# Altium schematic sheet KeyInput_MG.SchDoc
size A4
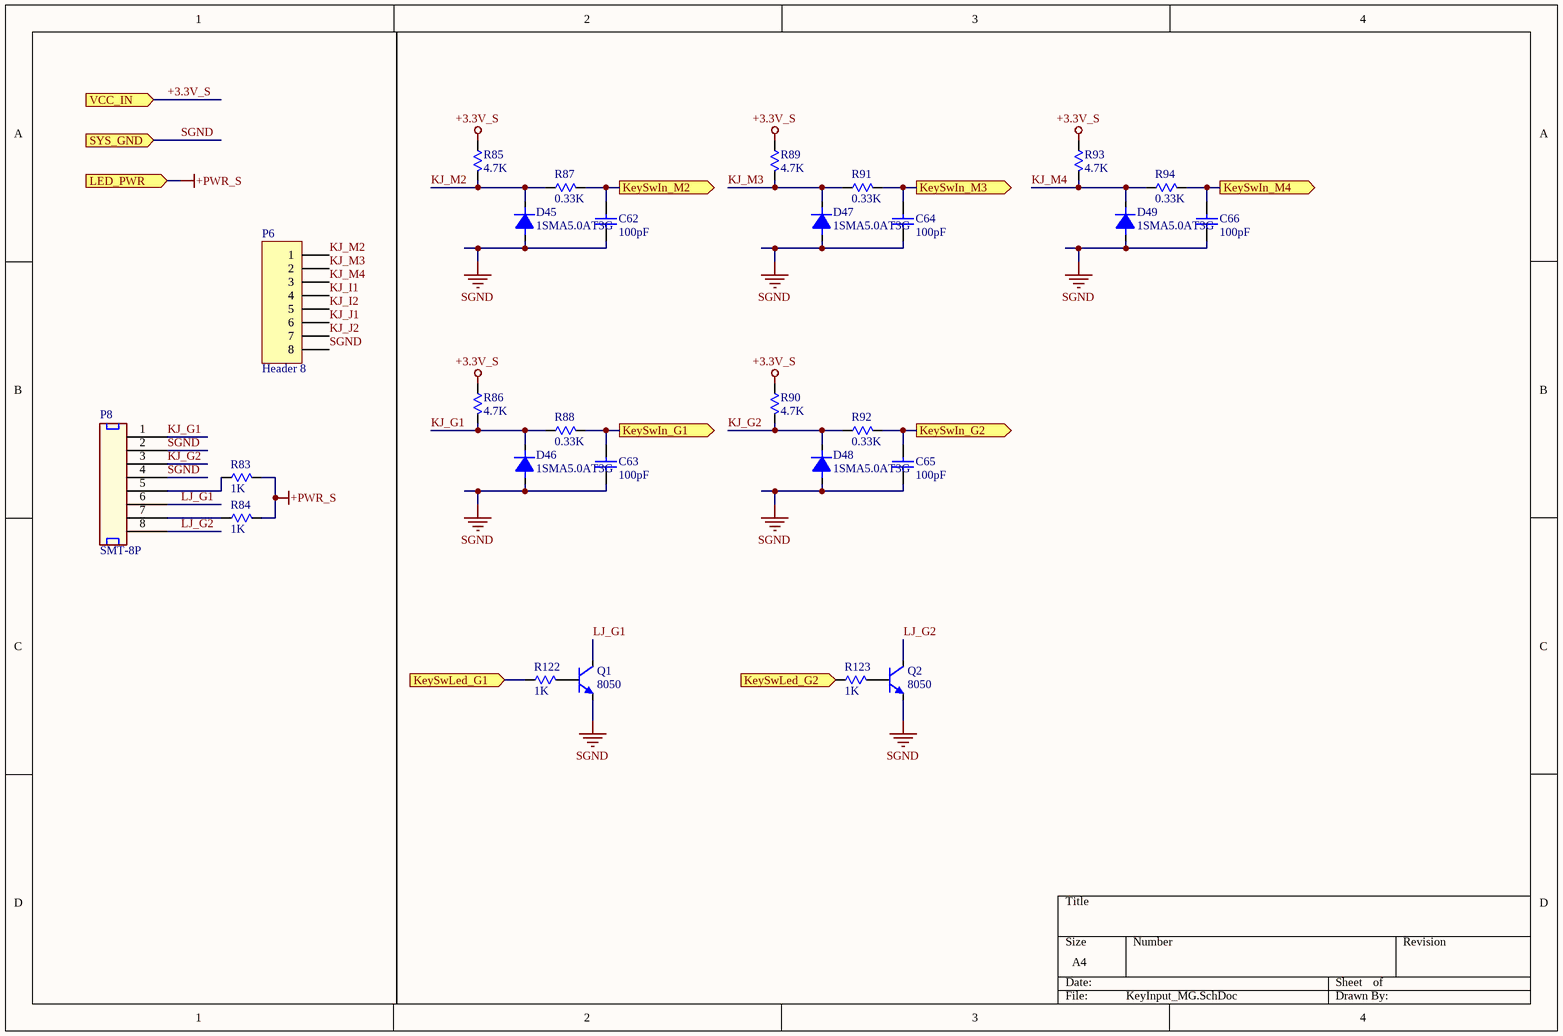
[diagram p0: KeyInput_MG.SchDoc]

## Parts
C62  100pF  [C0805]
C63  100pF  [C0805]
C64  100pF  [C0805]
C65  100pF  [C0805]
C66  100pF  [C0805]
D45  1SMA5.0AT3G  [SMA]
D46  1SMA5.0AT3G  [SMA]
D47  1SMA5.0AT3G  [SMA]
D48  1SMA5.0AT3G  [SMA]
D49  1SMA5.0AT3G  [SMA]
P6  Header 8  [FFC/SM1.0-8]
P8  SMT-8P  [1MM25_8PIN_SMT_R90]
Q1  8050  [SOT-23]
Q2  8050  [SOT-23]
R83  1K  [R0805]
R84  1K  [R0805]
R85  4.7K  [R0805]
R86  4.7K  [R0805]
R87  0.33K  [R0805]
R88  0.33K  [R0805]
R89  4.7K  [R0805]
R90  4.7K  [R0805]
R91  0.33K  [R0805]
R92  0.33K  [R0805]
R93  4.7K  [R0805]
R94  0.33K  [R0805]
R122  1K  [R0805]
R123  1K  [R0805]

## Ports
KeySwIn_G1 (out), KeySwIn_G2 (out), KeySwIn_M2 (out), KeySwIn_M3 (out), KeySwIn_M4 (out), KeySwLed_G1 (in), KeySwLed_G2 (in), LED_PWR (in), SYS_GND (in), VCC_IN (in)

## Nets
+3.3V_S: R85.2 R86.2 R89.2 R90.2 R93.2 ; port VCC_IN
+PWR_S: R83.1 R84.1 ; port LED_PWR
SGND: C62.2 C63.2 C64.2 C65.2 C66.2 D45.1(A) D46.1(A) D47.1(A) D48.1(A) D49.1(A) P6.8 P8.2 P8.4 Q1.2(E) Q2.2(E) ; port SYS_GND
KeySwIn_G1: C63.1 R88.1 ; port KeySwIn_G1
KeySwIn_G2: C65.1 R92.1 ; port KeySwIn_G2
KeySwIn_M2: C62.1 R87.1 ; port KeySwIn_M2
KeySwIn_M3: C64.1 R91.1 ; port KeySwIn_M3
KeySwIn_M4: C66.1 R94.1 ; port KeySwIn_M4
KeySwLed_G1: R122.2 ; port KeySwLed_G1
KeySwLed_G2: R123.2 ; port KeySwLed_G2
KJ_G1: D46.2(K) P8.1 R86.1 R88.2
KJ_G2: D48.2(K) P8.3 R90.1 R92.2
KJ_I1: P6.4
KJ_I2: P6.5
KJ_J1: P6.6
KJ_J2: P6.7
KJ_M2: D45.2(K) P6.1 R85.1 R87.2
KJ_M3: D47.2(K) P6.2 R89.1 R91.2
KJ_M4: D49.2(K) P6.3 R93.1 R94.2
LJ_G1: P8.6 Q1.3(C)
LJ_G2: P8.8 Q2.3(C)
NetP8_5: P8.5 R83.2
NetP8_7: P8.7 R84.2
NetQ1_1: Q1.1(B) R122.1
NetQ2_1: Q2.1(B) R123.1

## Library data of the parts
C62-C66 = Cap: Capacitor; Value: 22pF; Published: 8-Jun-2000; Revision: July-2002: Re-released for DXP Platform.; Publisher: Altium Limited
D45-D49 = DIODE1: Diode
P6 = Header 8: Header, 8-Pin; LatestRevisionDate: 17-Jul-2002; LatestRevisionNote: Re-released for DXP Platform.; Publisher: Altium Limited
Q1 Q2 = NPN: NPN General Purpose Amplifier; Published: 8-Jun-2000; LatestRevisionDate: 15-Jan-2003; LatestRevisionNote: PCB Footprint 'BCY-W3/D4.7' replaced; DatasheetDocument: 1997; PackageDocument: Sep-1998; PackageReference: TO-92A; Publisher: Altium Limited; Code_JEDEC: TO-92A; ComponentLink1Description: Manufacturer Link; ComponentLink1URL: http://www.fairchildsemi.com/; ComponentLink2Description: Datasheet; ComponentLink2URL: http://www.fairchildsemi.com/ds/2N%2F2N3904.pdf
R83-R94 R122 R123 = RES: Resistor; Published: 8-Jun-2000; LatestRevisionDate: 17-Jul-2002; LatestRevisionNote: Re-released for DXP Platform.; PackageReference: AXIAL-0.3; Publisher: Altium Limited
  R83 R84 R122 R123: Value: 1K
  R85 R86 R89 R90 R93: Value: 4.7K
  R87 R88 R91 R92 R94: Value: 0.33K